# EAGLE design driver_board_ribbon (EAGLE 6.2)
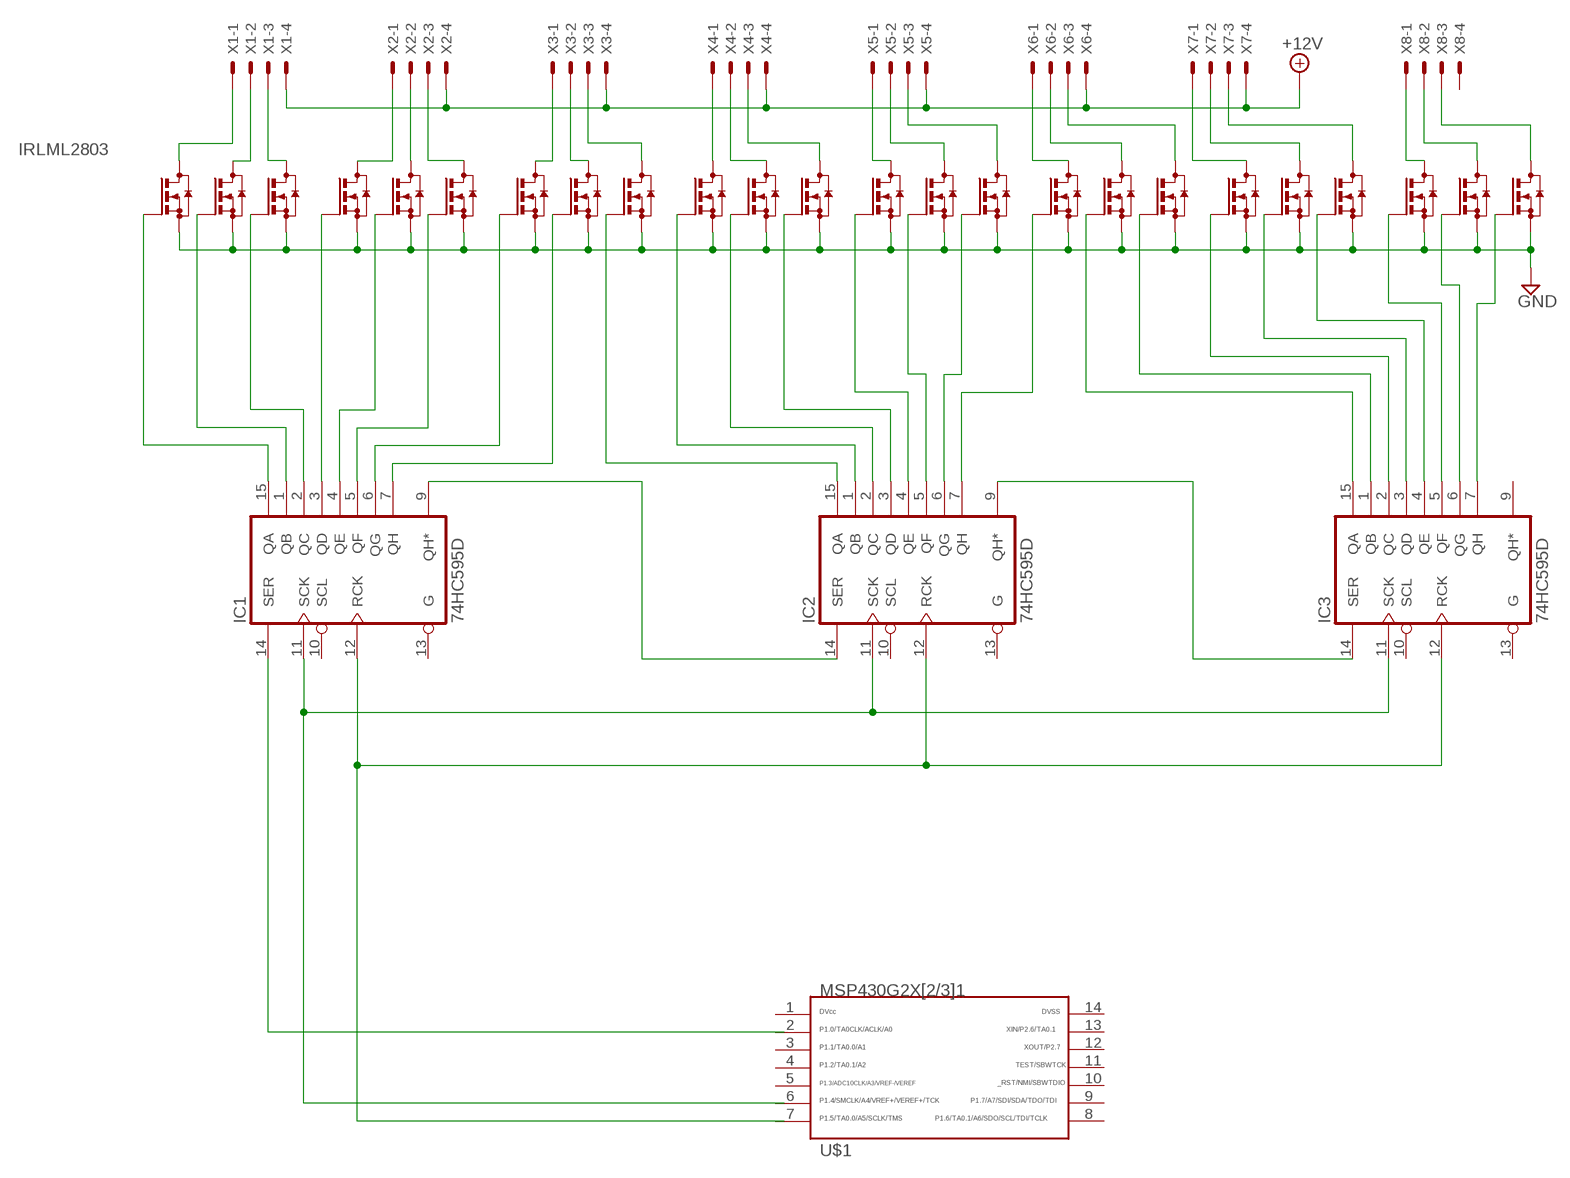
[diagram p0: schematic, sheet 1]

## Parts
IC1  74HC595D  [SO16]
IC2  74HC595D  [SO16]
IC3  74HC595D  [SO16]
U$1  G2X[2/3]1---PW14  [PW14]
U$3  IRLML2803  [SOT23]
U$4  IRLML2803  [SOT23]
U$5  IRLML2803  [SOT23]
U$6  IRLML2803  [SOT23]
U$7  IRLML2803  [SOT23]
U$8  IRLML2803  [SOT23]
U$9  IRLML2803  [SOT23]
U$10  IRLML2803  [SOT23]
U$11  IRLML2803  [SOT23]
U$12  IRLML2803  [SOT23]
U$13  IRLML2803  [SOT23]
U$14  IRLML2803  [SOT23]
U$15  IRLML2803  [SOT23]
U$16  IRLML2803  [SOT23]
U$17  IRLML2803  [SOT23]
U$18  IRLML2803  [SOT23]
U$19  IRLML2803  [SOT23]
U$20  IRLML2803  [SOT23]
U$21  IRLML2803  [SOT23]
U$22  IRLML2803  [SOT23]
U$23  IRLML2803  [SOT23]
U$24  IRLML2803  [SOT23]
U$25  IRLML2803  [SOT23]
U$26  IRLML2803  [SOT23]
X1  KK-156-4  [KK-156-4]
X2  KK-156-4  [KK-156-4]
X3  KK-156-4  [KK-156-4]
X4  KK-156-4  [KK-156-4]
X5  KK-156-4  [KK-156-4]
X6  KK-156-4  [KK-156-4]
X7  KK-156-4  [KK-156-4]
X8  KK-156-4  [KK-156-4]

## Nets
+12V: X1.4 X2.4 X3.4 X4.4 X5.4 X6.4 X7.4
GND: U$3.2(S) U$4.2(S) U$5.2(S) U$6.2(S) U$7.2(S) U$8.2(S) U$9.2(S) U$10.2(S) U$11.2(S) U$12.2(S) U$13.2(S) U$14.2(S) U$15.2(S) U$16.2(S) U$17.2(S) U$18.2(S) U$19.2(S) U$20.2(S) U$21.2(S) U$22.2(S) U$23.2(S) U$24.2(S) U$25.2(S) U$26.2(S)
N$1: IC1.9(QH*) IC2.14(SER)
N$2: IC2.9(QH*) IC3.14(SER)
N$3: IC1.11(SCK) IC2.11(SCK) IC3.11(SCK)
N$4: IC1.12(RCK) IC2.12(RCK) IC3.12(RCK)
N$5: U$3.3(D) X1.1
N$6: U$4.3(D) X1.2
N$7: U$5.3(D) X1.3
N$8: U$6.3(D) X2.1
N$9: U$7.3(D) X2.2
N$10: U$8.3(D) X2.3
N$11: U$9.3(D) X3.1
N$12: U$10.3(D) X3.2
N$13: U$11.3(D) X3.3
N$14: U$12.3(D) X4.1
N$15: U$13.3(D) X4.2
N$16: U$14.3(D) X4.3
N$17: U$15.3(D) X5.1
N$18: U$16.3(D) X5.2
N$19: U$17.3(D) X5.3
N$20: U$18.3(D) X6.1
N$21: U$19.3(D) X6.2
N$22: U$20.3(D) X6.3
N$23: U$21.3(D) X7.1
N$24: U$22.3(D) X7.2
N$25: U$23.3(D) X7.3
N$26: U$24.3(D) X8.1
N$27: U$25.3(D) X8.2
N$28: U$26.3(D) X8.3
N$29: IC1.7(QH) U$10.1(G)
N$30: IC1.6(QG) U$9.1(G)
N$31: IC1.5(QF) U$8.1(G)
N$32: IC1.4(QE) U$7.1(G)
N$33: IC1.3(QD) U$6.1(G)
N$34: IC1.2(QC) U$5.1(G)
N$35: IC1.1(QB) U$4.1(G)
N$36: IC1.15(QA) U$3.1(G)
N$37: IC2.15(QA) U$11.1(G)
N$38: IC2.1(QB) U$12.1(G)
N$39: IC2.2(QC) U$13.1(G)
N$40: IC2.3(QD) U$14.1(G)
N$41: IC2.4(QE) U$15.1(G)
N$42: IC2.5(QF) U$16.1(G)
N$43: IC2.6(QG) U$17.1(G)
N$44: IC2.7(QH) U$18.1(G)
N$45: IC3.15(QA) U$19.1(G)
N$46: IC3.1(QB) U$20.1(G)
N$47: IC3.2(QC) U$21.1(G)
N$48: IC3.3(QD) U$22.1(G)
N$49: IC3.4(QE) U$23.1(G)
N$50: IC3.5(QF) U$24.1(G)
N$51: IC3.6(QG) U$25.1(G)
N$52: IC3.7(QH) U$26.1(G)
N$53: IC1.14(SER)
Unconnected: IC1.10(SCL) IC1.13(G) IC2.10(SCL) IC2.13(G) IC3.9(QH*) IC3.10(SCL) IC3.13(G) U$1.1 U$1.2 U$1.3 U$1.4 U$1.5 U$1.6 U$1.7 U$1.8 U$1.9 U$1.10 U$1.11 U$1.12 U$1.13 U$1.14 X8.4

## Power pins joined to a net without a drawn wire
GND: IC1.8(GND) IC2.8(GND) IC3.8(GND)
VCC: IC1.16(VCC) IC2.16(VCC) IC3.16(VCC)

## Library data of the parts
IC1-IC3 = RobThePyro:74*595: 8-bit SHIFT REGISTER, output latch
U$1 = TI_MSP430_v16:G2X[2/3]1---PW14: MSP430G2X[2/3]1 TSSOP (PW) 14 Pin Package http://focus.ti.com/docs/prod/folders/print/msp430g2221.html MSP430G2121, MSP430G2221, MSP430G2131
U$3-U$26 = RobThePyro:IRLML2803
X1-X8 = con-molex:KK-156-4: KK 156 HEADER Source: http://www.molex.com/pdm_docs/sd/026604100_sd.pdf; OC_FARNELL: unknown; OC_NEWARK: unknown

## Board
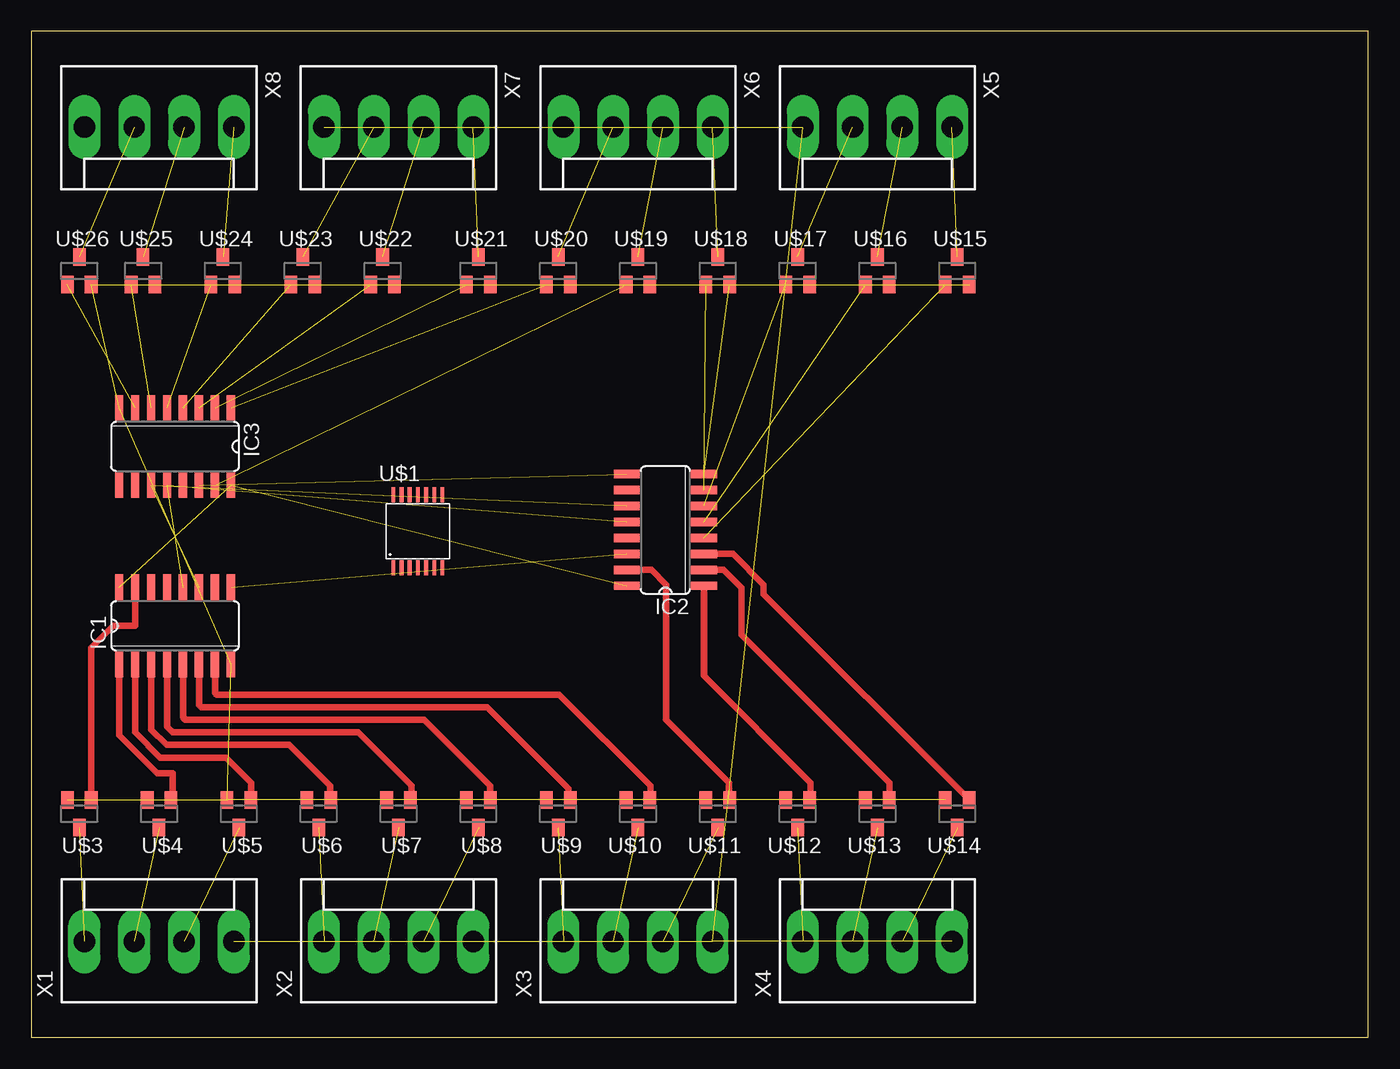
[diagram p1: board, top side]

Size 106.35 x 80 mm. Coordinates in mm from the lower left corner, seen from the top.
Outline: 0,0 106.35,0 106.35,80 0,80 0,0
Copper layers (1*16): Top 0.035mm / dielectric 1.5mm / Bottom 0.035mm
Design rules: minimum track width 10mil, minimum drill 24mil, track to track 8mil, track to pad 8mil, pad to pad 8mil, via to via 8mil, smd to smd 8mil, copper to edge 40mil, drill to drill 8mil, minimum pad ring 10mil, minimum via ring 8mil, stop-mask expansion 4mil, vias tented up to drill 0mil, thermal gap 10mil

### Footprints (pad centres in the part's own frame; a part is rotated, then mirrored left to right if it is on the bottom)
SO16 = smd 0.66 x 2.032: 1 -4.445,-3.073; 2 -3.175,-3.073; 3 -1.905,-3.073; 4 -0.635,-3.073; 5 0.635,-3.073; 6 1.905,-3.073; 7 3.175,-3.073; 8 4.445,-3.073; 9 4.445,3.073; 10 3.175,3.073; 11 1.905,3.073; 12 0.635,3.073; 13 -0.635,3.073; 14 -1.905,3.073; 15 -3.175,3.073; 16 -4.445,3.073
PW14 = smd 0.3 x 1.2: 1 -1.95,-2.9; 2 -1.3,-2.9; 3 -0.65,-2.9; 4 0,-2.9; 5 0.65,-2.9; 6 1.3,-2.9; 7 1.95,-2.9; 8 1.95,2.9; 9 1.3,2.9; 10 0.65,2.9; 11 0,2.9; 12 -0.65,2.9; 13 -1.3,2.9; 14 -1.95,2.9
SOT23 = smd 1 x 1.4: 1 -0.95,-1.1; 2 0.95,-1.1; 3 0,1.1
KK-156-4 = drill 1.7 pad 2.184 long: 1 -5.94,0; 2 -1.98,0; 3 1.98,0; 4 5.94,0

### Placement (x,y rotation side)
IC1  11.43,32.73 0 top
IC2  50.44,40.35 90 top
IC3  11.43,46.99 180 top
U$1  30.75,40.25 0 top
U$3  3.81,17.78 180 top
U$4  10.16,17.78 180 top
U$5  16.51,17.78 180 top
U$6  22.86,17.78 180 top
U$7  29.21,17.78 180 top
U$8  35.56,17.78 180 top
U$9  41.91,17.78 180 top
U$10  48.26,17.78 180 top
U$11  54.61,17.78 180 top
U$12  60.96,17.78 180 top
U$13  67.31,17.78 180 top
U$14  73.66,17.78 180 top
U$15  73.66,60.96 0 top
U$16  67.31,60.96 0 top
U$17  60.96,60.96 0 top
U$18  54.61,60.96 0 top
U$19  48.26,60.96 0 top
U$20  41.91,60.96 0 top
U$21  35.56,60.96 0 top
U$22  27.94,60.96 0 top
U$23  21.59,60.96 0 top
U$24  15.24,60.96 0 top
U$25  8.89,60.96 0 top
U$26  3.81,60.96 0 top
X1  10.16,7.62 0 top
X2  29.21,7.62 0 top
X3  48.26,7.62 0 top
X4  67.31,7.62 0 top
X5  67.31,72.39 180 top
X6  48.26,72.39 180 top
X7  29.21,72.39 180 top
X8  10.16,72.39 180 top

### Tracks (layer width: path | path; a pad name or v marks a point on that pad's centre or on a via)
+12V  (6 unrouted)
GND  (26 unrouted)
N$1  (1 unrouted)
N$2  (1 unrouted)
N$3  (2 unrouted)
N$4  (2 unrouted)
N$5  (1 unrouted)
N$6  (1 unrouted)
N$7  (1 unrouted)
N$8  (1 unrouted)
N$9  (1 unrouted)
N$10  (1 unrouted)
N$11  (1 unrouted)
N$12  (1 unrouted)
N$13  (1 unrouted)
N$14  (1 unrouted)
N$15  (1 unrouted)
N$16  (1 unrouted)
N$17  (1 unrouted)
N$18  (1 unrouted)
N$19  (1 unrouted)
N$20  (1 unrouted)
N$21  (1 unrouted)
N$22  (1 unrouted)
N$23  (1 unrouted)
N$24  (1 unrouted)
N$25  (1 unrouted)
N$26  (1 unrouted)
N$27  (1 unrouted)
N$28  (1 unrouted)
N$29
  Top 0.508: IC1.7 14.61,27.39 14.75,27.25 42,27.25 49.25,20 49.25,18.92 U$10.1
N$30
  Top 0.508: IC1.6 13.34,26.41 13.5,26.25 36.25,26.25 42.75,19.75 42.75,18.99 U$9.1
N$31
  Top 0.508: IC1.5 12.06,25.43 12.25,25.25 31.25,25.25 36.5,20 U$8.1
N$32
  Top 0.508: IC1.4 10.79,24.7 11.25,24.25 26,24.25 30.25,20 30.25,18.97 U$7.1
N$33
  Top 0.508: IC1.3 9.53,24.48 10.75,23.25 20.5,23.25 23.75,20 23.75,18.94 U$6.1
N$34
  Top 0.508: IC1.2 8.26,24.25 10.25,22.25 15.5,22.25 17.5,20.25 17.5,18.92 U$5.1
N$35
  Top 0.508: IC1.1 6.99,24.02 10,21 11.25,21 11.25,19.02 U$4.1
N$36
  Top 0.508: IC1.15 8.26,32.76 8.25,32.75 6.5,32.75 4.75,31 U$3.1
N$37
  Top 0.508: IC2.15 49.33,37.17 50.5,36 50.5,25.25 55.5,20.25 55.5,18.94 U$11.1
N$38
  Top 0.508: IC2.1 53.51,28.74 62,20.25 62,18.97 U$12.1
N$39
  Top 0.508: IC2.2 55.08,37.17 56.5,35.75 56.5,32 68.25,20.25 U$13.1
N$40
  Top 0.508: IC2.3 55.8,38.45 58.25,36 58.25,35.24 U$14.1
N$41  (1 unrouted)
N$42  (1 unrouted)
N$43  (1 unrouted)
N$44  (1 unrouted)
N$45  (1 unrouted)
N$46  (1 unrouted)
N$47  (1 unrouted)
N$48  (1 unrouted)
N$49  (1 unrouted)
N$50  (1 unrouted)
N$51  (1 unrouted)
N$52  (1 unrouted)
VCC  (2 unrouted)